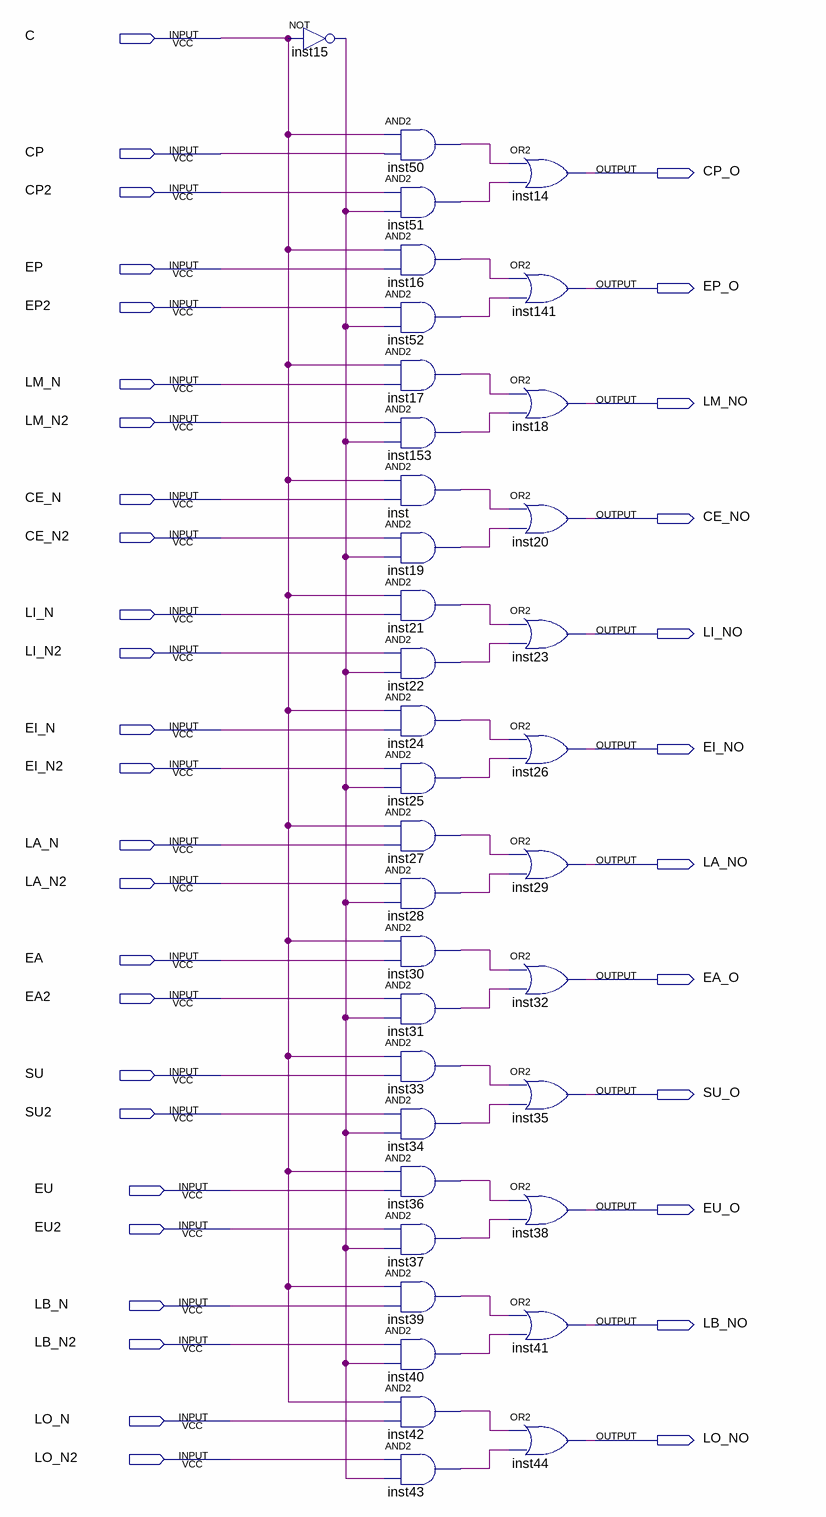
[diagram p0: schematic sheet]
// Quartus schematic Mux_Ciclo.bdf as structural Verilog: 37 symbols, 37 pins
module Mux_Ciclo (
  input  C,
  input  CP,
  input  CP2,
  input  EP,
  input  EP2,
  input  LM_N,
  input  LM_N2,
  input  CE_N,
  input  CE_N2,
  input  LI_N,
  input  LI_N2,
  input  EI_N,
  input  EI_N2,
  input  LA_N,
  input  LA_N2,
  input  EA,
  input  EA2,
  input  SU,
  input  SU2,
  input  EU,
  input  EU2,
  input  LB_N,
  input  LB_N2,
  input  LO_N,
  input  LO_N2,
  output CP_O,
  output EP_O,
  output LM_NO,
  output CE_NO,
  output LI_NO,
  output EI_NO,
  output LA_NO,
  output EA_O,
  output SU_O,
  output EU_O,
  output LB_NO,
  output LO_NO
);

  wire inst15_out, inst16_out, inst17_out, inst19_out, inst21_out, inst22_out, inst24_out, inst25_out,
       inst27_out, inst28_out, inst30_out, inst31_out, inst33_out, inst34_out, inst36_out, inst37_out,
       inst39_out, inst40_out, inst42_out, inst43_out, inst50_out, inst51_out, inst52_out, inst153_out,
       inst_out;

  not inst15 (inst15_out, C);
  and inst50 (inst50_out, C, CP);
  and inst51 (inst51_out, CP2, inst15_out);
  and inst16 (inst16_out, C, EP);
  and inst52 (inst52_out, EP2, inst15_out);
  and inst17 (inst17_out, C, LM_N);
  and inst153 (inst153_out, LM_N2, inst15_out);
  and inst (inst_out, C, CE_N);
  and inst19 (inst19_out, CE_N2, inst15_out);
  and inst21 (inst21_out, C, LI_N);
  and inst22 (inst22_out, LI_N2, inst15_out);
  and inst24 (inst24_out, C, EI_N);
  and inst25 (inst25_out, EI_N2, inst15_out);
  and inst27 (inst27_out, C, LA_N);
  and inst28 (inst28_out, LA_N2, inst15_out);
  and inst30 (inst30_out, C, EA);
  and inst31 (inst31_out, EA2, inst15_out);
  and inst33 (inst33_out, C, SU);
  and inst34 (inst34_out, SU2, inst15_out);
  and inst36 (inst36_out, C, EU);
  and inst37 (inst37_out, EU2, inst15_out);
  and inst39 (inst39_out, C, LB_N);
  and inst40 (inst40_out, LB_N2, inst15_out);
  and inst42 (inst42_out, C, LO_N);
  and inst43 (inst43_out, LO_N2, inst15_out);
  or inst14 (CP_O, inst50_out, inst51_out);
  or inst141 (EP_O, inst16_out, inst52_out);
  or inst18 (LM_NO, inst17_out, inst153_out);
  or inst20 (CE_NO, inst_out, inst19_out);
  or inst23 (LI_NO, inst21_out, inst22_out);
  or inst26 (EI_NO, inst24_out, inst25_out);
  or inst29 (LA_NO, inst27_out, inst28_out);
  or inst32 (EA_O, inst30_out, inst31_out);
  or inst35 (SU_O, inst33_out, inst34_out);
  or inst38 (EU_O, inst36_out, inst37_out);
  or inst41 (LB_NO, inst39_out, inst40_out);
  or inst44 (LO_NO, inst42_out, inst43_out);
endmodule
